# EAGLE design akabeacon_mini_da14580 (EAGLE 7.2.0)
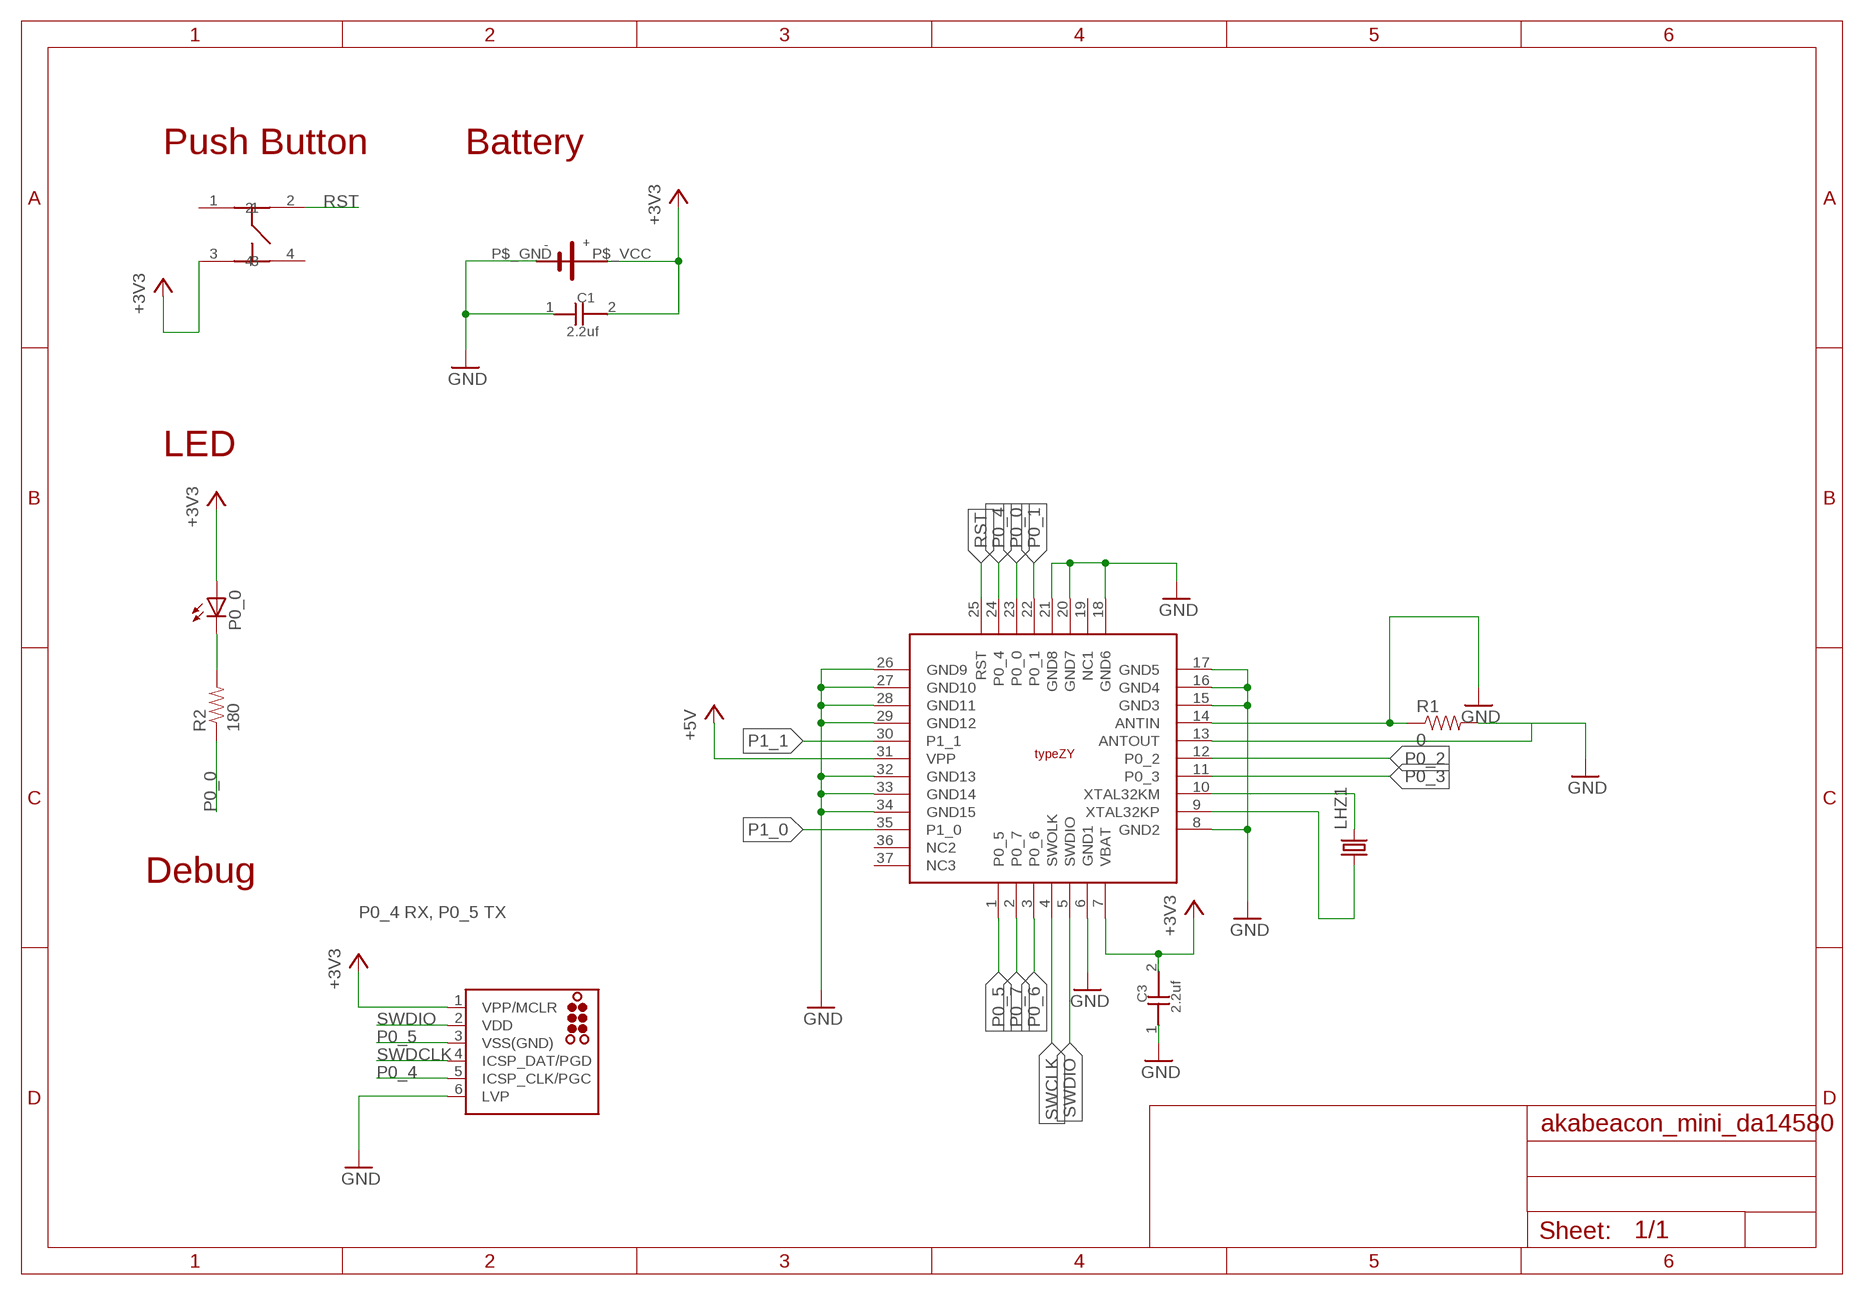
[diagram p0: schematic, sheet 1]

## Parts
C1  2.2uf  CAPACITOR0603  [0603]
C3  2.2uf  CAPACITOR0603  [0603]
J2  TC2030-MCP  [TC2030-MCP]
LHZ1  FC-12M  [FC-12M]
P0_0  LEDCHIP-LED0603  [CHIP-LED0603]
R1  0  RESISTOR0603-RES  [0603-RES]
R2  180  RESISTOR0603-RES  [0603-RES]
U$1  MURATA-TYPEZY  [MURATA_TYPEZY]
U$6  SMTU2450-BOTTOM-MINI  [SMTU2450-BOTTOM-MINI]
U$7  SWICTH-4P(KMR2)  [SWITCH-4P(KMR2)]

## Nets
+3V3: C1.2 C3.2 J2.1(VPP/MCLR) P0_0.A U$1.7(VBAT) U$6.P$_VCC U$7.3
+5V: U$1.31(VPP)
GND: C1.1 C3.1 J2.6(LVP) R1.1 R1.2 U$1.6(GND1) U$1.8(GND2) U$1.14(ANTIN) U$1.15(GND3) U$1.16(GND4) U$1.17(GND5) U$1.18(GND6) U$1.20(GND7) U$1.21(GND8) U$1.26(GND9) U$1.27(GND10) U$1.28(GND11) U$1.29(GND12) U$1.32(GND13) U$1.33(GND14) U$1.34(GND15) U$6.P$_GND
LED1: P0_0.C R2.2
N$1: U$1.13(ANTOUT)
P0_0: R2.1 U$1.23(P0_0)
P0_1: U$1.22(P0_1)
P0_2: U$1.12(P0_2)
P0_3: U$1.11(P0_3)
P0_4: J2.5(ICSP_CLK/PGC) U$1.24(P0_4)
P0_5: J2.3(VSS(GND)) U$1.1(P0_5)
P0_6: U$1.3(P0_6)
P0_7: U$1.2(P0_7)
P1_0: U$1.35(P1_0)
P1_1: U$1.30(P1_1)
RST: U$1.25(RST) U$7.2
SWCLK: U$1.4(SWOLK)
SWDCLK: J2.4(ICSP_DAT/PGD)
SWDIO: J2.2(VDD) U$1.5(SWDIO)
XTAL32KM: LHZ1.2 U$1.10(XTAL32KM)
XTAL32KP: LHZ1.1 U$1.9(XTAL32KP)
Unconnected: U$1.19(NC1) U$1.36(NC2) U$1.37(NC3) U$7.1 U$7.4

## Notes on the sheet
- Push Button | Battery
- LED
- Debug
- P0_4 RX, P0_5 TX

## Library data of the parts
C1 C3 = GClue-Capacitor:CAPACITOR
J2 = tag-connect:TC2030: TAG-CONNECT ICSP Connector Manufacturer: Tag-Connect <http://www.tag-connect.com> Cable for easy In-Circuit Serial Programming. Designed for Microchip ICD2, suitable for many others. Two variants - one "with legs" (for hands-free fit on PCB) and another "without legs" for quick programming. PAD Description 1 MCLR/Vpp 2 Vdd 3 GND 4 PGD (ISPDAT) 5 PGC (ISPCLK) 6 nc (used for LVP) ©2009 ROFA.cz - modified and updated by Robert Darlington ‹rdarlington@gmail.com›
LHZ1 = crystal:FC-12M: kHz RANGE CRYSTAL UNIT LOW PROFILE SMD Source: Epson Toyocom FC-12M.pdf
P0_0 = led:LED: LED OSRAM: - CHIPLED LG R971, LG N971, LY N971, LG Q971, LY Q971, LO R971, LY R971 LH N974, LH R974 LS Q976, LO Q976, LY Q976 LO Q996 - Hyper CHIPLED LW Q18S LB Q993, LB Q99A, LB R99A - SideLED LS A670, LO A670, LY A670, LG A670, LP A670 LB A673, LV A673, LT A673, LW A673 LH A674 LY A675 LS A676, LA A676, LO A676, LY A676, LW A676 LS A679, LY A679, LG A679 - Hyper Micro SIDELED® LS Y876, LA Y876, LO Y876, LY Y876 LT Y87S - SmartLED LW L88C, LW L88S LB L89C, LB L89S, LG L890 LS L89K, LO L89K, LY L89K LS L896, LA L896, LO L896, LY L896 - TOPLED LS T670, LO T670, LY T670, LG T670, LP T670 LSG T670, LSP T670, LSY T670, LOP T670, LYG T670 LG T671, LOG T671, LSG T671 LB T673, LV T673, LT T673, LW T673 LH T674 LS T676, LA T676, LO T676, LY T676, LB T676, LH T676, LSB T676, LW T676 LB T67C, LV T67C, LT T67C, LS T67K, LO T67K, LY T67K, LW E67C LS E67B, LA E67B, LO E67B, LY E67B, LB E67C, LV E67C, LT E67C LW T67C LS T679, LY T679, LG T679 LS T770, LO T770, LY T770, LG T770, LP T770 LB T773, LV T773, LT T773, LW T773 LH T774 LS E675, LA E675, LY E675, LS T675 LS T776, LA T776, LO T776, LY T776, LB T776 LHGB T686 LT T68C, LB T68C - Hyper Mini TOPLED® LB M676 - Mini TOPLED Santana® LG M470 LS M47K, LO M47K, LY M47K Source: http://www.osram.convergy.de LUXEON: - LUMILED® LXK2-PW12-R00, LXK2-PW12-S00, LXK2-PW14-U00, LXK2-PW14-V00 LXK2-PM12-R00, LXK2-PM12-S00, LXK2-PM14-U00 LXK2-PE12-Q00, LXK2-PE12-R00, LXK2-PE12-S00, LXK2-PE14-T00, LXK2-PE14-U00 LXK2-PB12-K00, LXK2-PB12-L00, LXK2-PB12-M00, LXK2-PB14-N00, LXK2-PB14-P00, LXK2-PB14-Q00 LXK2-PR12-L00, LXK2-PR12-M00, LXK2-PR14-Q00, LXK2-PR14-R00 LXK2-PD12-Q00, LXK2-PD12-R00, LXK2-PD12-S00 LXK2-PH12-R00, LXK2-PH12-S00 LXK2-PL12-P00, LXK2-PL12-Q00, LXK2-PL12-R00 Source: www.luxeon.com KINGBRIGHT: KA-3528ASYC Source: www.kingbright.com
R1 R2 = SparkFun:RESISTOR: Resistor Basic schematic elements and footprints for 0603, 1206, and PTH resistors.
U$1 = GClueBT:MURATA-TYPEZY
U$6 = gclue:SMTU2450-BOTTOM-MINI
U$7 = gclue-test:SWICTH-4P(KMR2)

## Board
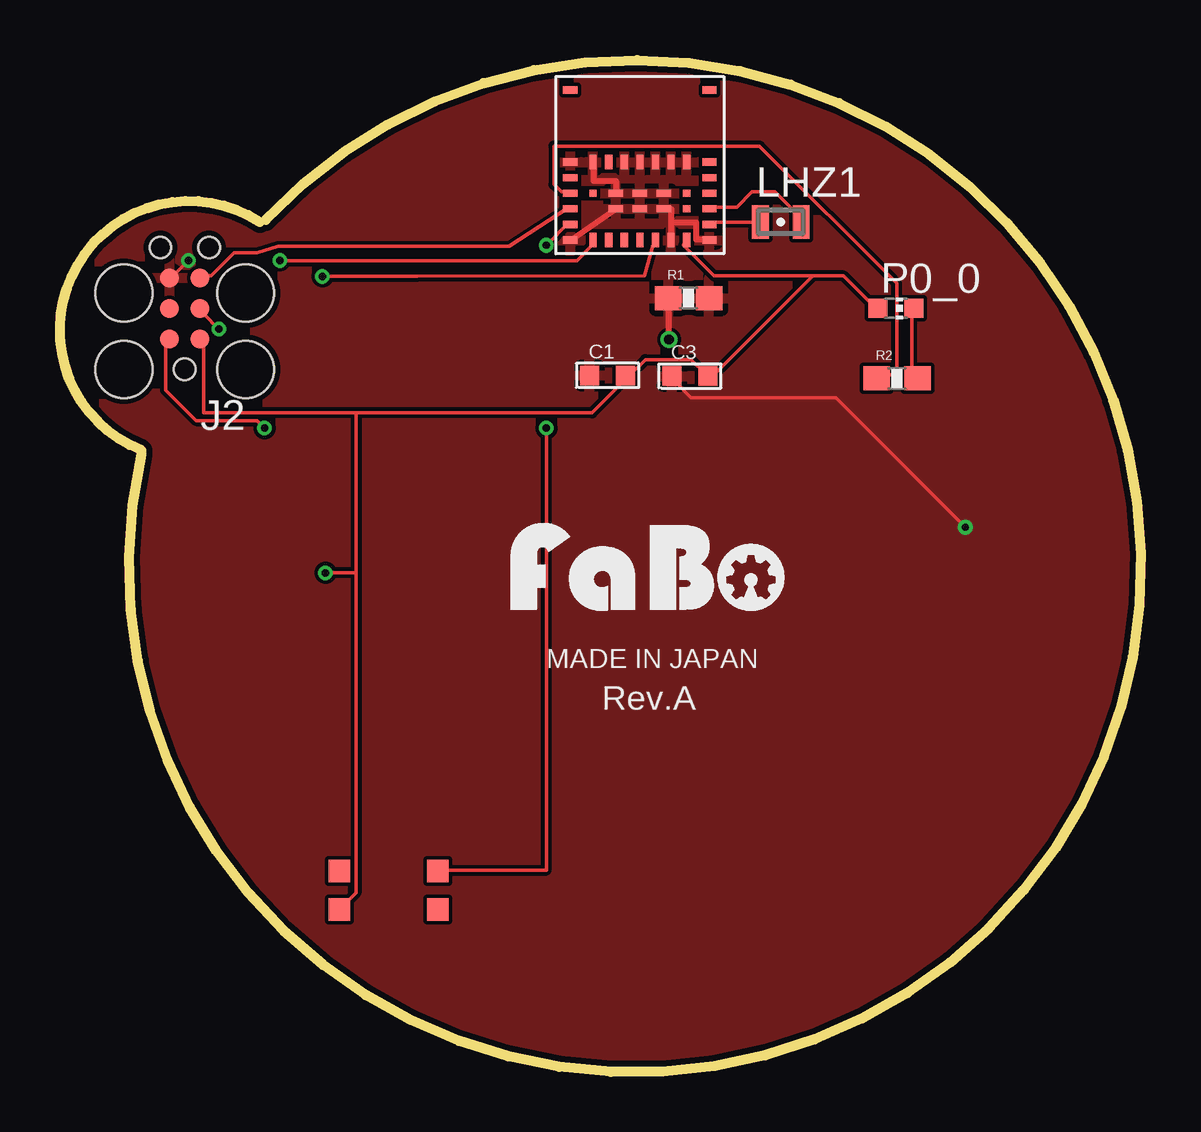
[diagram p1: board, top side]
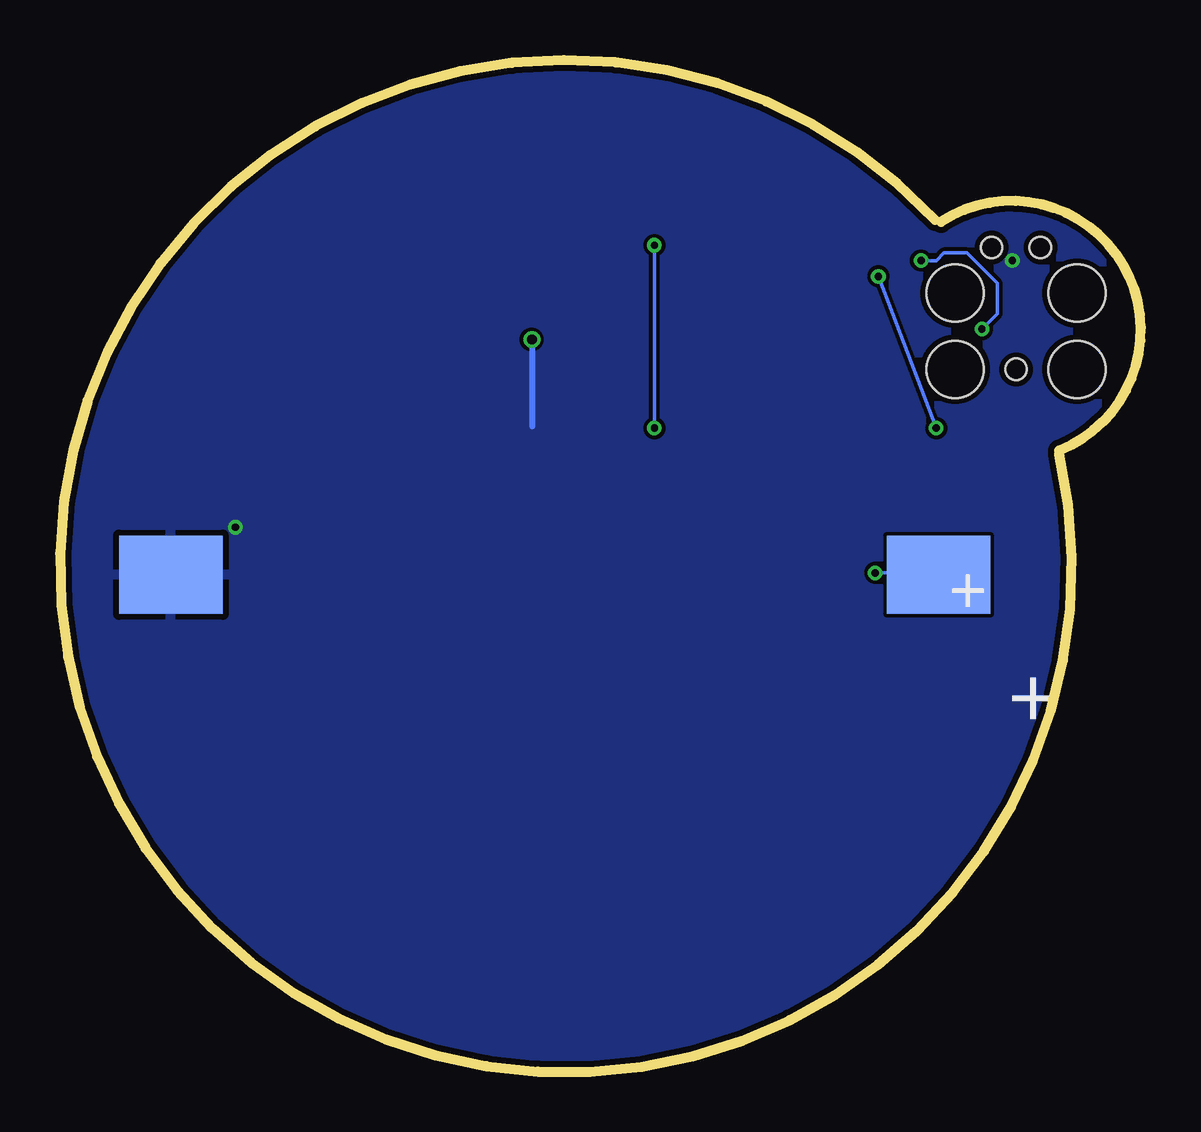
[diagram p2: board, bottom side, seen from below]

Size 45.05 x 42.16 mm. Coordinates in mm from the lower left corner, seen from the top.
Outline: 8.58,35.5 arc-330 3.4,25.74
Outline: 3.4,25.9 arc-191 8.33,35.42
Copper layers (1*16): Top 0.035mm / dielectric 1.5mm / Bottom 0.035mm
Design rules "SeeedStudio_2layer_DRU_no_angle_20140221": minimum track width 6mil, minimum drill 12mil, track to track 6mil, track to pad 6mil, pad to pad 6mil, via to via 6mil, smd to smd 0mil, copper to edge 10mil, drill to drill 10mil, minimum pad ring 10mil, minimum via ring 6mil, stop-mask expansion 2mil, vias tented up to drill 100mil, thermal gap 10mil

### Footprints (pad centres in the part's own frame; a part is rotated, then mirrored left to right if it is on the bottom)
0603 = smd 0.8 x 0.8: 1 -0.75,0; 2 0.75,0
TC2030-MCP = smd 0.787 x 0.787: 1 1.27,-0.635; 2 1.27,0.635; 3 2.54,-0.635; 4 2.54,0.635; 5 3.81,-0.635; 6 3.81,0.635 | hole 0.889: 0,0; 5.08,-1.016; 5.08,1.016 | hole 2.375: 0,2.54; 0,-2.54; 3.175,-2.54; 3.175,2.54
FC-12M = smd 0.7 x 1.4: 1 -0.85,0; 2 0.85,0
CHIP-LED0603 = smd 0.8 x 0.8: A 0,-0.75; C 0,0.75
0603-RES = smd 1.1 x 1: 1 -0.85,0; 2 0.85,0
MURATA_TYPEZY = smd 0.3 x 0.6: 1 -1.95,-1.625; 2 -1.3,-1.625; 3 -0.65,-1.625; 4 0,-1.625; 5 0.65,-1.625; 6 1.3,-1.625; 7 1.95,-1.625; 14 1.95,1.625; 15 1.3,1.625; 16 0.65,1.625; 17 0,1.625; 18 -0.65,1.625; 19 -1.3,1.625; 20 -1.95,1.625 | smd 0.6 x 0.3: 8 2.9,-1.625; 9 2.9,-0.975; 10 2.9,-0.325; 11 2.9,0.325; 12 2.9,0.975; 13 2.9,1.625; 21 -2.9,1.625; 22 -2.9,0.975; 23 -2.9,0.325; 24 -2.9,-0.325; 25 -2.9,-0.975; 26 -2.9,-1.625; 27 -1,-0.325; 28 0,-0.325; 29 1,-0.325; 32 1,0.325; 33 0,0.325; 34 -1,0.325; 36 2.9,4.625; 37 -2.9,4.625 | smd 0.3 x 0.3: 30 1.95,-0.325; 31 1.95,0.325; 35 -1.95,0.325
SMTU2450-BOTTOM-MINI = smd 3.251 x 4.318 bottom: P$_GND 0,-16; P$_VCC 0,16
SWITCH-4P(KMR2) = smd 0.9 x 0.95: 1 -1,0; 2 3.1,0; 3 -1,-1.6; 4 3.1,-1.6

### Placement (x,y rotation side)
C1  22.83,29.02 0 top
C3  26.26,28.99 0 top
J2  5.2,29.27 90 top
LHZ1  30.04,35.42 0 top
P0_0  34.84,31.81 270 top
R1  26.21,32.25 0 top
R2  34.89,28.89 0 top
U$1  24.17,36.28 0 top
U$2  [LOGO_FABO_M]  24.5,19.22 0 top
U$6  24.43,20.71 90 top
U$7  12.64,8.37 0 top

### Tracks (layer width: path | path; a pad name or v marks a point on that pad's centre or on a via)
+3V3  (via drill 0.3)
  Top 0.152: 31.39,33.17 32.66,33.17 33.93,31.9 P0_0.A | 31.39,33.17 27.26,33.17 25.99,34.44 U$1.7 | 31.39,33.17 27.26,29.05 C3.2 26.94,29.05 26.31,29.68 24.4,29.68 23.77,29.05 C1.2 23.45,28.73 22.18,27.46 12.34,27.46 | 12.34,27.46 5.99,27.46 5.99,30.32 J2.1 | 12.34,27.46 12.34,20.79 | 12.34,20.79 12.34,7.46 11.7,6.82 U$7.3 | 12.34,20.79 v11.07,20.79
  Bottom 0.152: v11.07,20.79 8.53,20.79 U$6.P$_VCC
GND  (via drill 0.3, 0.38)
  Top 0.152: v5.35,33.81 4.72,33.17 J2.6 | v37.74,22.7 32.34,28.09 26.31,28.09 25.67,28.73 C3.1
  Top 0.254: U$1.20 22.24,37.91 22.24,37.12 23.17,37.12 U$1.34 | U$1.26 U$1.27 | U$1.29 25.47,35.96 U$1.6 25.5,34.66 25.5,35.4 26.51,35.4 26.51,34.68 27.07,34.68 U$1.8 | R1.1 v25.37,30.52
  Bottom 0.254: v25.37,30.52 25.37,26.89
  pour Bottom: 5.25,-0.67 46.93,-0.65 47.06,45.43 -3.21,45.45 -3.36,-0.7
  pour Top: -3.03,-0.19 46.91,-0.67 47.14,45.38 -3.03,45.63
LED1
  Top 0.152: P0_0.C 35.52,31.59 35.52,29.05 R2.2
P0_0
  Top 0.152: U$1.23 21.23,36.67 20.91,36.67 20.59,36.98 20.59,38.57 29.17,38.57 34.88,32.86 34.88,29.05 34.25,29.05 R2.1
P0_4
  Top 0.152: U$1.24 21.23,36.03 18.73,34.39 9.09,34.39 8.21,34.13 7.26,34.13 6.31,33.17 5.99,33.17 J2.5
P0_5  (via drill 0.3)
  Top 0.152: v9.16,33.81 21.55,33.81 22.18,34.44 U$1.1 | v6.62,30.95 5.99,31.59 J2.3
  Bottom 0.152: v9.16,33.81 8.53,33.81 8.21,34.13 7.26,34.13 5.99,32.86 5.99,31.59 v6.62,30.95
RST  (via drill 0.3)
  Top 0.152: v20.28,34.44 21.23,35.4 U$1.25 | v20.28,26.82 20.28,8.41 15.83,8.41 U$7.2
  Bottom 0.152: v20.28,26.82 v20.28,34.44
S$1  (via drill 0.38)
  other vias: 25.39,30.52
SWDIO  (via drill 0.3)
  Top 0.152: v10.94,33.15 14.88,33.15 24.37,33.17 24.72,34.44 U$1.5 | v8.53,26.82 8.21,27.14 5.67,27.14 4.4,28.41 4.4,30.32 J2.2
  Bottom 0.152: v8.53,26.82 v10.94,33.15
XTAL32KM
  Top 0.152: U$1.10 27.26,36.03 28.21,36.03 28.85,36.67 29.8,36.67 30.75,35.71 LHZ1.2
XTAL32KP
  Top 0.152: U$1.9 27.26,35.4 29.17,35.4 LHZ1.1

### Text on the board
tPlace: MADE IN JAPAN | Rev.A
bPlace: +